# Altium project STLink_V2_Design.PrjPcb
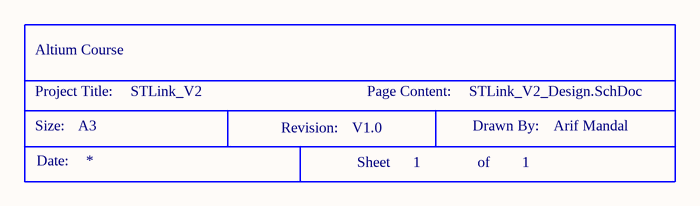
[diagram p0: STLink_V2_Design.SchDoc]
NameProject: STLink_V2
1 sheet, 1 parts. Net scope: global (net labels, ports and power ports of the same name join across sheets).
Board file: STLink_V2_Design.PcbDoc

## Sheet STLink_V2_Design.SchDoc
size A3; DocumentNumber: 1; Revision: V1.0; SheetNumber: 1; SheetTotal: 1

### Parts
*  Size: A3  Drawn By: Arif Mandal  (hidden comment: Title Block)  (graphical)

### Notes on the sheet
- (in symbol Title Block) Altium Course; Project Title:; Page Content:; Size:; Revision:; Drawn By:; Date:; Sheet; of